# Altium schematic sheet Thermistors.SchDoc
size A4; SheetNumber: 3; SheetTotal: 5
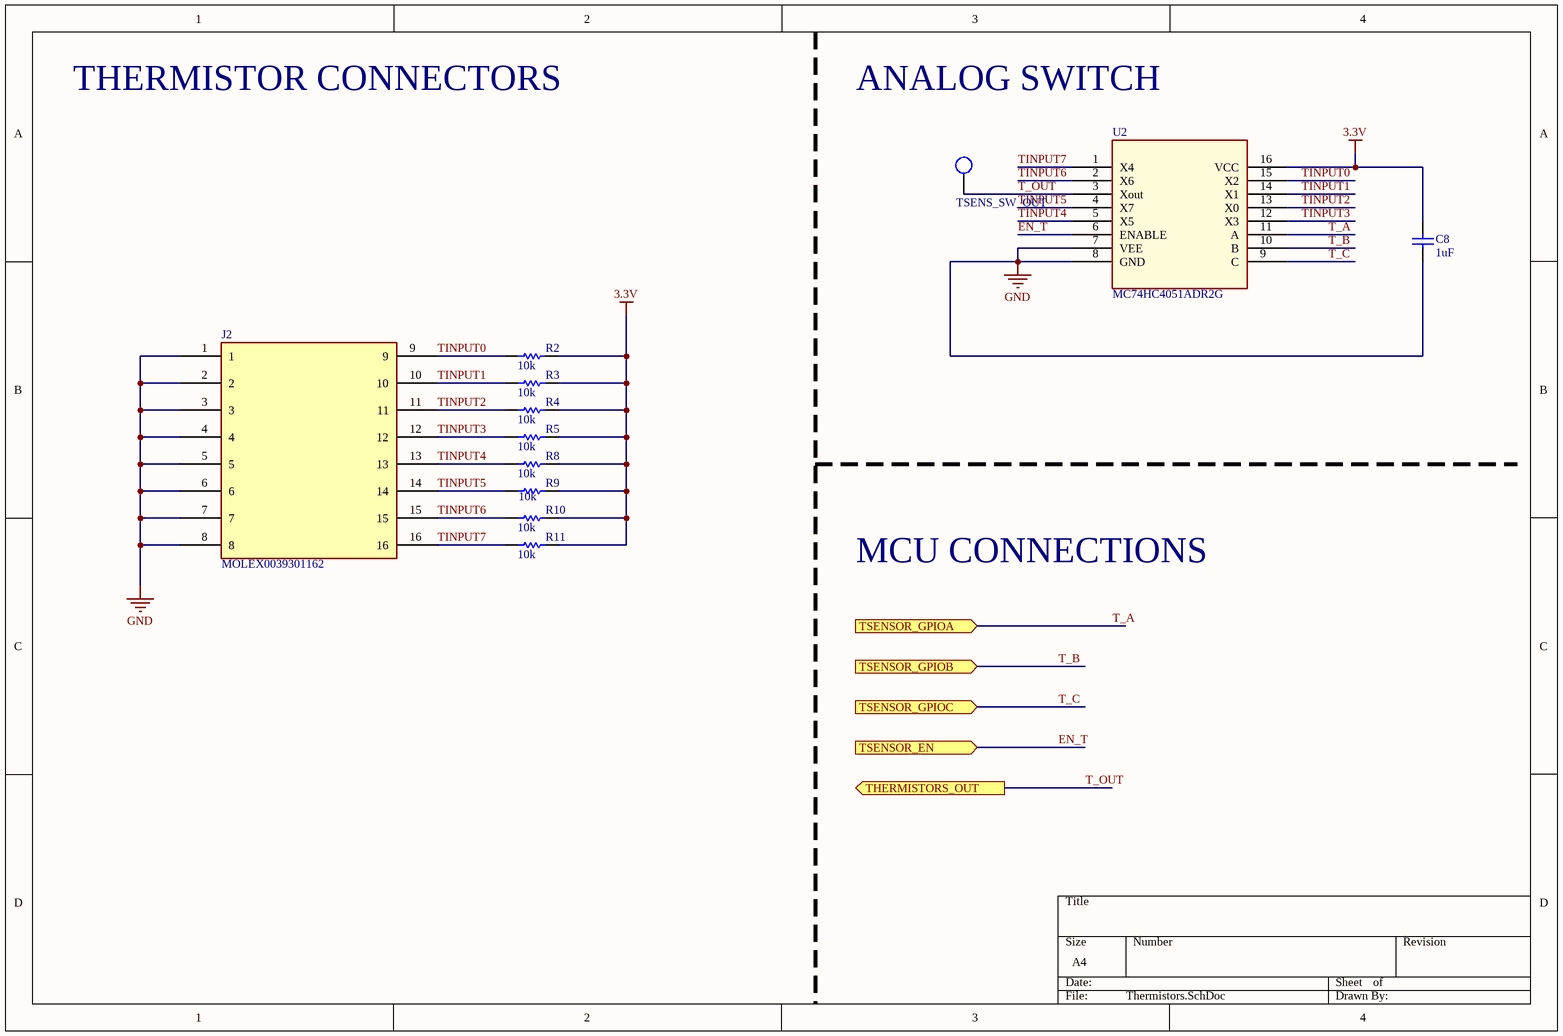
[diagram p0: Thermistors.SchDoc]

## Parts
C8  value 1uF  [0603 - Capacitor]  (hidden comment: Capacitor - Nonpolarized)
J2  MOLEX0039301162  [MOLEX0039301162]
R2  value 10k  [0805 - Resistor]  (hidden comment: Resistor)
R3  value 10k  [0805 - Resistor]  (hidden comment: Resistor)
R4  value 10k  [0805 - Resistor]  (hidden comment: Resistor)
R5  value 10k  [0805 - Resistor]  (hidden comment: Resistor)
R8  value 10k  [0805 - Resistor]  (hidden comment: Resistor)
R9  value 10k  [0805 - Resistor]  (hidden comment: Resistor)
R10  value 10k  [0805 - Resistor]  (hidden comment: Resistor)
R11  value 10k  [0805 - Resistor]  (hidden comment: Resistor)
TSENS_SW_OUT  Test Point  [Test Point - 5002]  (value not drawn)  (no BOM)
U2  MC74HC4051ADR2G  [MC74HC4051ADR2G]

## Ports
THERMISTORS_OUT (out), TSENSOR_EN (in), TSENSOR_GPIOA (in), TSENSOR_GPIOB (in), TSENSOR_GPIOC (in)

## Nets
3.3V: C8.2 R2.1 R3.1 R4.1 R5.1 R8.1 R9.1 R10.1 R11.1 U2.16(VCC)
GND: C8.1 J2.1 J2.2 J2.3 J2.4 J2.5 J2.6 J2.7 J2.8 U2.7(VEE) U2.8(GND)
EN_T: U2.6(ENABLE) ; port TSENSOR_EN
T_A: U2.11(A) ; port TSENSOR_GPIOA
T_B: U2.10(B) ; port TSENSOR_GPIOB
T_C: U2.9(C) ; port TSENSOR_GPIOC
T_OUT: TSENS_SW_OUT.1 U2.3(Xout) ; port THERMISTORS_OUT
TINPUT0: J2.9 R2.2 U2.15(X2)
TINPUT1: J2.10 R3.2 U2.14(X1)
TINPUT2: J2.11 R4.2 U2.13(X0)
TINPUT3: J2.12 R5.2 U2.12(X3)
TINPUT4: J2.13 R8.2 U2.5(X5)
TINPUT5: J2.14 R9.2 U2.4(X7)
TINPUT6: J2.15 R10.2 U2.2(X6)
TINPUT7: J2.16 R11.2 U2.1(X4)

## Notes on the sheet
- THERMISTOR CONNECTORS
- ANALOG SWITCH
- MCU CONNECTIONS

## Library data of the parts
C8 = Capacitor - Nonpolarized: Nonpolarized Capacitor; Supplier Part Number: *; Supplier: *; Manufacturer: *; Rating: *; Manufacturer Part Number: *
J2 = MOLEX0039301162: Connector Header Through Hole, Right Angle 16 position 0.165" (4.20mm); Manufacturer: Molex; Manufacturer Part Number: 0039301082; Supplier: DigiKey; Supplier Part Number: WM21366-ND; ComponentLink1Description: Datasheet; ComponentLink1URL: https://www.molex.com/pdm_docs/sd/039301082_sd.pdf
U2 = MC74HC4051ADR2G: 1 Circuit IC Switch 8:1 100Ohm 16-SOIC; Manufacturer Name: onsemi; Manufacturer Part Number: MC74HC4051ADR2G; Supplier Name: Digikey; Supplier Part Number: MC74HC4051ADR2GOSTR-ND
R2-R5 R8-R11 = Resistor: Rating: *; Manufacturer Part Number: *; Manufacturer: *; Supplier Part Number: *; Supplier: *